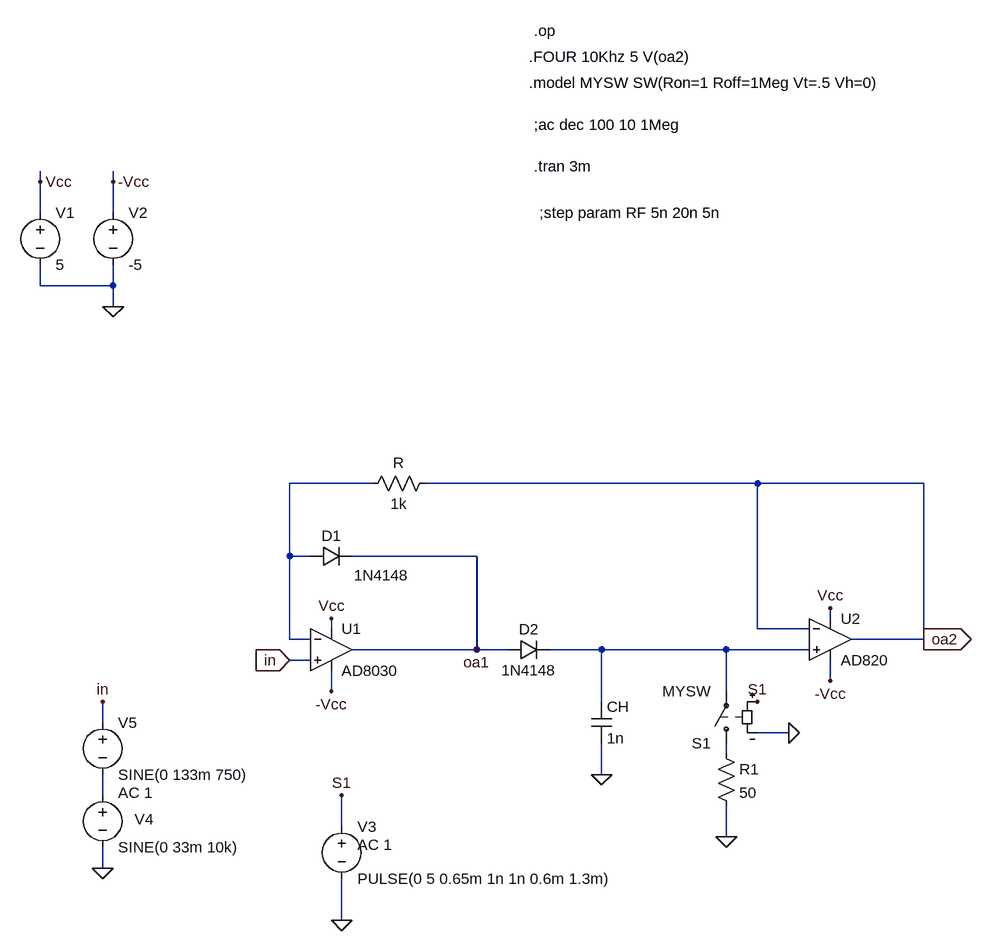
[diagram p0: schematic etaj4_.asc]
etaj4_.asc, the LTspice schematic file:
Version 4
SHEET 1 880 680
WIRE -736 -560 -736 -576
WIRE -624 -560 -624 -576
WIRE -736 -512 -736 -560
WIRE -624 -512 -624 -560
WIRE -736 -400 -736 -432
WIRE -624 -400 -624 -432
WIRE -624 -400 -736 -400
WIRE -624 -368 -624 -400
WIRE -224 -96 -352 -96
WIRE 368 -96 -144 -96
WIRE 624 -96 368 -96
WIRE -352 16 -352 -96
WIRE -320 16 -352 16
WIRE -64 16 -256 16
WIRE 480 112 480 96
WIRE -288 128 -288 112
WIRE 368 128 368 -96
WIRE 448 128 368 128
WIRE -352 144 -352 16
WIRE -320 144 -352 144
WIRE 624 144 624 -96
WIRE 624 144 512 144
WIRE -64 160 -64 16
WIRE -64 160 -256 160
WIRE -16 160 -64 160
WIRE 128 160 48 160
WIRE 320 160 128 160
WIRE 448 160 320 160
WIRE -320 176 -352 176
WIRE 480 208 480 176
WIRE -288 224 -288 192
WIRE 320 224 320 160
WIRE 128 240 128 160
WIRE -640 272 -640 240
WIRE 416 288 368 288
WIRE 320 320 320 304
WIRE 128 352 128 304
WIRE -640 384 -640 352
WIRE -272 432 -272 384
WIRE 320 448 320 400
WIRE -640 496 -640 464
WIRE -272 576 -272 512
FLAG -288 112 Vcc
FLAG -288 224 -Vcc
FLAG 480 96 Vcc
FLAG 480 208 -Vcc
FLAG 128 352 0
FLAG 624 144 oa2
IOPIN 624 144 Out
FLAG -624 -368 0
FLAG -736 -560 Vcc
FLAG -624 -560 -Vcc
FLAG -64 160 oa1
FLAG -640 496 0
FLAG -352 176 in
IOPIN -352 176 In
FLAG 320 448 0
FLAG 416 288 0
FLAG 368 240 S1
FLAG -272 384 S1
FLAG -272 576 0
FLAG -640 240 in
SYMBOL diode -320 32 R270
WINDOW 0 32 32 VTop 2
WINDOW 3 2 109 VBottom 2
SYMATTR InstName D1
SYMATTR Value 1N4148
SYMBOL diode -16 176 R270
WINDOW 0 32 32 VTop 2
WINDOW 3 0 32 VBottom 2
SYMATTR InstName D2
SYMATTR Value 1N4148
SYMBOL res -128 -112 R90
WINDOW 0 0 56 VBottom 2
WINDOW 3 32 56 VTop 2
SYMATTR InstName R
SYMATTR Value 1k
SYMBOL cap 112 240 R0
SYMATTR InstName CH
SYMATTR Value 1n
SYMBOL OpAmps\\AD8030 -288 96 R0
SYMATTR InstName U1
SYMBOL voltage -736 -528 R0
WINDOW 123 0 0 Left 2
WINDOW 39 0 0 Left 2
SYMATTR InstName V1
SYMATTR Value 5
SYMBOL voltage -624 -528 R0
WINDOW 123 0 0 Left 2
WINDOW 39 0 0 Left 2
SYMATTR InstName V2
SYMATTR Value -5
SYMBOL voltage -640 368 R0
WINDOW 123 0 0 Left 2
WINDOW 39 0 0 Left 2
WINDOW 0 49 53 Left 2
SYMATTR InstName V4
SYMATTR Value SINE(0 33m 10k)
SYMBOL voltage -640 256 R0
WINDOW 123 24 124 Left 2
WINDOW 39 0 0 Left 2
SYMATTR Value2 AC 1
SYMATTR InstName V5
SYMATTR Value SINE(0 133m 750)
SYMBOL OpAmps\\AD820 480 80 R0
SYMATTR InstName U2
SYMBOL sw 320 320 R180
SYMATTR InstName S1
SYMATTR Value MYSW
SYMBOL res 304 304 R0
SYMATTR InstName R1
SYMATTR Value 50
SYMBOL voltage -272 416 R0
WINDOW 123 24 44 Left 2
WINDOW 39 0 0 Left 0
SYMATTR Value2 AC 1
SYMATTR InstName V3
SYMATTR Value PULSE(0 5 0.65m 1n 1n 0.6m 1.3m)
TEXT 24 -792 Left 2 !.op
TEXT 24 -648 Left 2 !;ac dec 100 10 1Meg
TEXT 24 -584 Left 2 !.tran 3m
TEXT 16 -712 Left 2 !.model MYSW SW(Ron=1 Roff=1Meg Vt=.5 Vh=0)
TEXT 16 -752 Left 2 !.FOUR 10Khz 5 V(oa2)
TEXT 32 -512 Left 2 !;step param RF 5n 20n 5n

The netlist it stands for:
* etaj4_.asc
D1 N001 oa1 1N4148
D2 oa1 N002 1N4148
R oa2 N001 1k
CH N002 0 1n
XU1 in N001 Vcc -Vcc oa1 AD8040  ; AD8030, pins In+ In- V+ V- OUT
V1 Vcc 0 5
V2 -Vcc 0 -5
V4 N004 0 SINE(0 33m 10k)
V5 in N004 SINE(0 133m 750) AC 1
XU2 N002 oa2 Vcc -Vcc oa2 AD820  ; pins In+ In- V+ V- OUT
S1 N003 N002 S1 0 MYSW
R1 N003 0 50
V3 S1 0 PULSE(0 5 0.65m 1n 1n 0.6m 1.3m) AC 1
.model D D
.lib standard.dio
.op
;ac dec 100 10 1Meg
.tran 3m
.model MYSW SW(Ron=1 Roff=1Meg Vt=.5 Vh=0)
.FOUR 10Khz 5 V(oa2)
;step param RF 5n 20n 5n
.lib ADI.lib
.backanno
.end